# Altium project display.PrjPcb
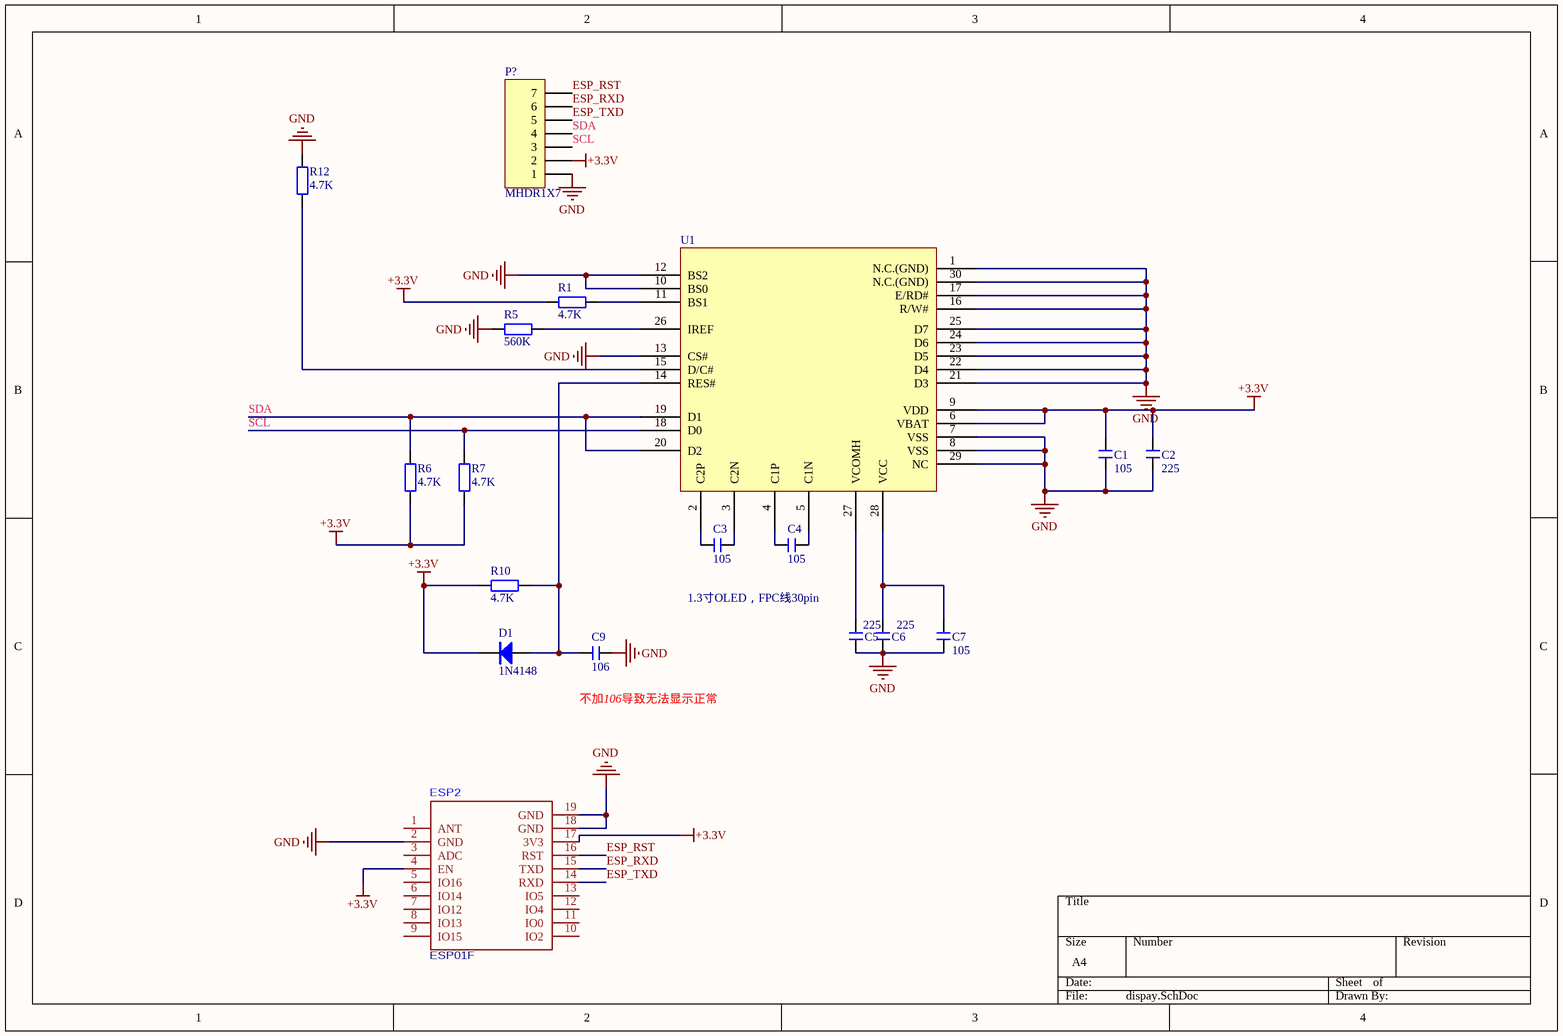
[diagram p0: dispay.SchDoc]
1 sheet, 18 parts. Net scope: global (net labels, ports and power ports of the same name join across sheets).
Board file: display.PcbDoc

## Sheet dispay.SchDoc
size A4

### Parts
C1  105  [C 0603_L]
C2  225  [C 0603_L]
C3  105  [C 0603_L]
C4  105  [C 0603_L]
C5  225  [C 0603_L]
C6  225  [C 0603_L]
C7  105  [C 0603_L]
C9  106  [C 0603_L]
D1  1N4148  [SOD-323]
ESP2  ESP01F  [ESP-01F]
P?  MHDR1X7  [MHDR1X7]
R1  4.7K  [R 0603_L]
R5  560K  [R 0603_L]
R6  4.7K  [R 0603_L]
R7  4.7K  [R 0603_L]
R10  4.7K  [R 0603_L]
R12  4.7K  [R 0603_L]
U1  1.3寸OLED，FPC线30pin  [0.96OLED-仅焊盘]

### Nets
+3.3V: C1.2 C2.2 D1.2(K) ESP2.4(EN) ESP2.17(3V3) P?.2 R1.1 R6.1 R7.1 R10.1 U1.6(VBAT) U1.9(VDD)
GND: C1.1 C2.1 C5.1 C6.1 C7.1 C9.2 ESP2.2(GND) ESP2.18(GND) ESP2.19(GND) P?.1 R5.1 R12.2 U1.1(N.C.(GND)) U1.7(VSS) U1.8(VSS) U1.10(BS0) U1.12(BS2) U1.13(CS#) U1.16(R/W#) U1.17(E/RD#) U1.21(D3) U1.22(D4) U1.23(D5) U1.24(D6) U1.25(D7) U1.29(NC) U1.30(N.C.(GND))
ESP_RST: ESP2.16(RST) P?.7
ESP_RXD: ESP2.15(TXD) P?.6
ESP_TXD: ESP2.14(RXD) P?.5
SCL: P?.3 R7.2 U1.18(D0)
SDA: P?.4 R6.2 U1.19(D1) U1.20(D2)
NetC3_1: C3.1 U1.2(C2P)
NetC3_2: C3.2 U1.3(C2N)
NetC4_1: C4.1 U1.4(C1P)
NetC4_2: C4.2 U1.5(C1N)
NetC5_2: C5.2 U1.27(VCOMH)
NetC6_2: C6.2 C7.2 U1.28(VCC)
NetC9_1: C9.1 D1.1(A) R10.2 U1.14(RES#)
NetR1_2: R1.2 U1.11(BS1)
NetR5_2: R5.2 U1.26(IREF)
NetR12_1: R12.1 U1.15(D/C#)

Not connected (* = marked no-connect by the designer): ESP2 1(ANT) 3(ADC) 5(IO16) 6(IO14) 7(IO12) 8(IO13) 9(IO15) 10(IO2) 11(IO0) 12(IO4) 13(IO5)

### Notes on the sheet
- (near C9) 不加106导致无法显示正常

### Library data of the parts
C1-C7 C9 = C: 无极性贴片电容; 版权归属: 源创客; 材质: X7R; BOM名称: 无极性贴片电容; 学习资源: www.ooocke.com
D1 = 1N4148: 高速开关二极管; 版权归属: 源创客; BOM名称: 高速开关二极管; 学习资源: www.ooocke.com
P? = MHDR1X7: Header, 7-Pin; LatestRevisionDate: 17-Jul-2002; LatestRevisionNote: Re-released for DXP Platform.; Publisher: Altium Limited
R1 R5-R7 R10 R12 = R: 贴片电阻; 版权归属: 源创客; BOM名称: 贴片电阻; 学习资源: www.ooocke.com